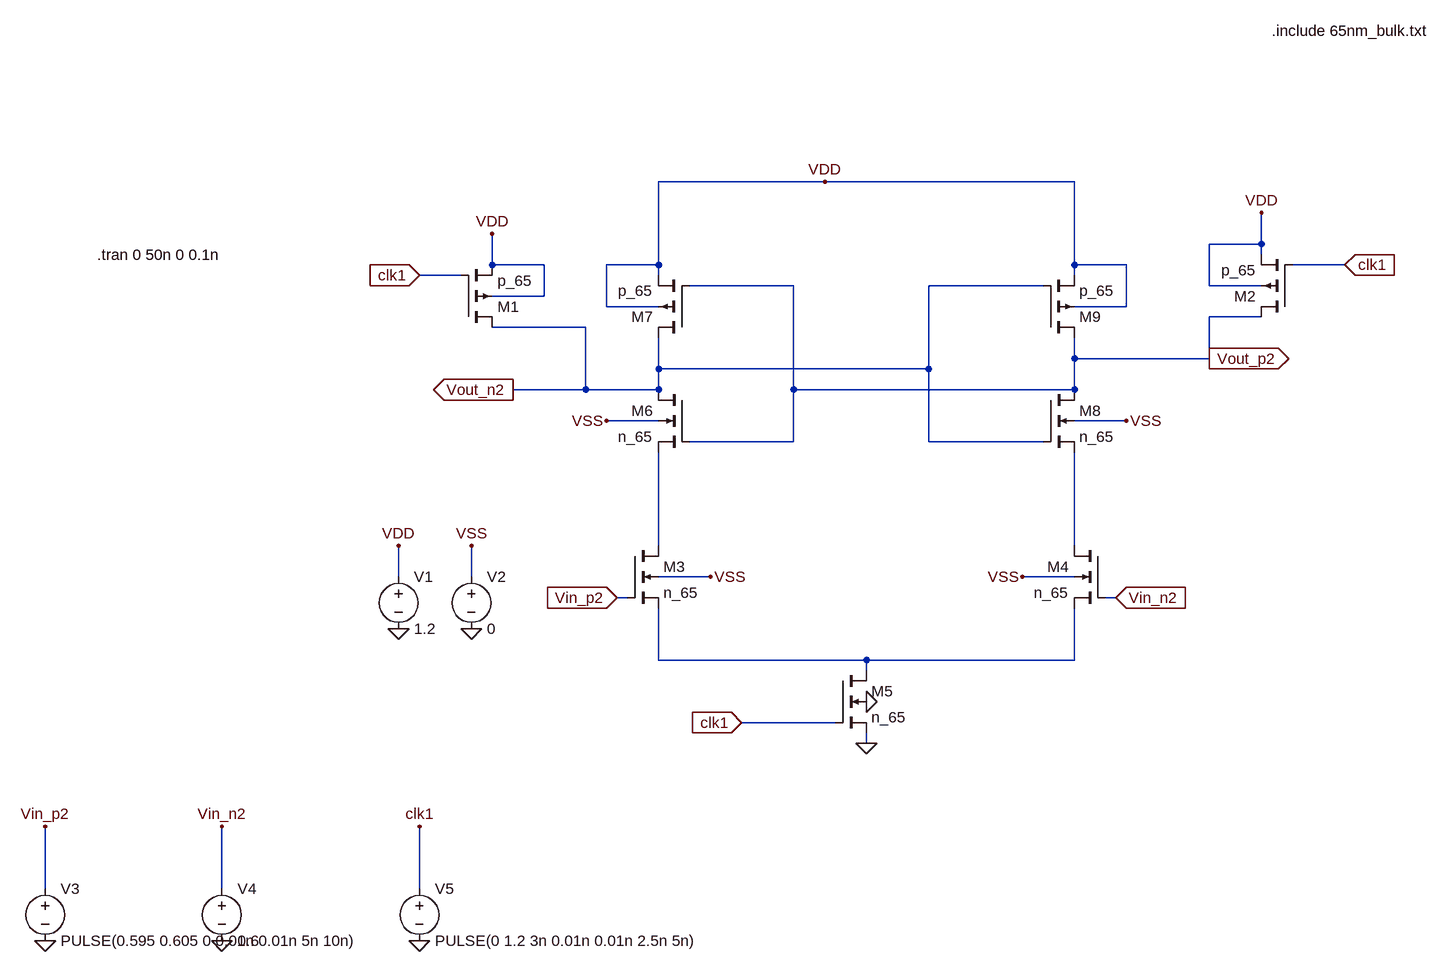
[diagram p0: schematic dyn_comp_testing.asc]
dyn_comp_testing.asc, the LTspice schematic file:
Version 4
SHEET 1 1784 1136
WIRE 848 -48 592 -48
WIRE 1232 -48 848 -48
WIRE 1520 48 1520 0
WIRE 1520 48 1440 48
WIRE 1520 64 1520 48
WIRE 336 80 336 32
WIRE 416 80 336 80
WIRE 592 80 592 -48
WIRE 592 80 512 80
WIRE 1232 80 1232 -48
WIRE 1312 80 1232 80
WIRE 1648 80 1568 80
WIRE 288 96 224 96
WIRE 592 96 592 80
WIRE 1232 96 1232 80
WIRE 800 112 640 112
WIRE 1184 112 1008 112
WIRE 1440 112 1440 48
WIRE 1520 112 1440 112
WIRE 416 128 416 80
WIRE 416 128 336 128
WIRE 512 144 512 80
WIRE 592 144 512 144
WIRE 1312 144 1312 80
WIRE 1312 144 1232 144
WIRE 1520 160 1440 160
WIRE 480 176 336 176
WIRE 1232 224 1232 192
WIRE 1440 224 1440 160
WIRE 1440 224 1232 224
WIRE 592 240 592 192
WIRE 1008 240 1008 112
WIRE 1008 240 592 240
WIRE 480 272 480 176
WIRE 480 272 368 272
WIRE 592 272 592 240
WIRE 592 272 480 272
WIRE 800 272 800 112
WIRE 1232 272 1232 224
WIRE 1232 272 800 272
WIRE 592 320 512 320
WIRE 1312 320 1232 320
WIRE 800 352 800 272
WIRE 800 352 640 352
WIRE 1008 352 1008 240
WIRE 1184 352 1008 352
WIRE 592 512 592 368
WIRE 1232 512 1232 368
WIRE 192 560 192 512
WIRE 304 560 304 512
WIRE 672 560 592 560
WIRE 1232 560 1152 560
WIRE 544 592 528 592
WIRE 1296 592 1280 592
WIRE 592 688 592 608
WIRE 912 688 592 688
WIRE 1232 688 1232 608
WIRE 1232 688 912 688
WIRE 912 704 912 688
WIRE 864 784 720 784
WIRE 912 816 912 800
WIRE -352 1040 -352 944
WIRE -80 1040 -80 944
WIRE 224 1040 224 944
FLAG 192 640 0
FLAG 192 512 VDD
FLAG 304 640 0
FLAG 304 512 VSS
FLAG 336 32 VDD
FLAG 1520 0 VDD
FLAG 224 96 clk1
IOPIN 224 96 In
FLAG 1648 80 clk1
IOPIN 1648 80 In
FLAG 720 784 clk1
IOPIN 720 784 In
FLAG 1296 592 Vin_n2
IOPIN 1296 592 In
FLAG 528 592 Vin_p2
IOPIN 528 592 In
FLAG 912 816 0
FLAG 1152 560 VSS
FLAG 672 560 VSS
FLAG 912 752 0
FLAG 848 -48 VDD
FLAG 512 320 VSS
FLAG 1312 320 VSS
FLAG 368 272 Vout_n2
IOPIN 368 272 Out
FLAG 1440 224 Vout_p2
IOPIN 1440 224 Out
FLAG 224 1120 0
FLAG -80 1120 0
FLAG -352 1120 0
FLAG 224 944 clk1
FLAG -80 944 Vin_n2
FLAG -352 944 Vin_p2
SYMBOL Voltage 192 544 R0
SYMATTR InstName V1
SYMATTR Value 1.2
SYMBOL Voltage 304 544 R0
SYMATTR InstName V2
SYMATTR Value 0
SYMBOL pmos4 288 176 M180
SYMATTR InstName M1
SYMATTR Value p_65
SYMATTR Value2 l=65n w=1u
SYMBOL pmos4 1568 160 R180
SYMATTR InstName M2
SYMATTR Value p_65
SYMATTR Value2 l=65n w=1u
SYMBOL nmos4 544 512 R0
SYMATTR InstName M3
SYMATTR Value n_65
SYMATTR Value2 l=0.1u w=10u
SYMBOL nmos4 1280 512 M0
SYMATTR InstName M4
SYMATTR Value n_65
SYMATTR Value2 l=0.1u w=10u
SYMBOL nmos4 864 704 R0
SYMATTR InstName M5
SYMATTR Value n_65
SYMATTR Value2 l=1u w=20u
SYMBOL nmos4 640 272 M0
SYMATTR InstName M6
SYMATTR Value n_65
SYMATTR Value2 l=65n w=0.8u
SYMBOL pmos4 640 192 R180
SYMATTR InstName M7
SYMATTR Value p_65
SYMATTR Value2 l=65n w=1.6u
SYMBOL nmos4 1184 272 R0
SYMATTR InstName M8
SYMATTR Value n_65
SYMATTR Value2 l=65n w=0.8u
SYMBOL pmos4 1184 192 M180
SYMATTR InstName M9
SYMATTR Value p_65
SYMATTR Value2 l=65n w=1.6u
SYMBOL voltage -352 1024 R0
SYMATTR InstName V3
SYMATTR Value PULSE(0.595 0.605 0 0.01n 0.01n 5n 10n)
SYMBOL voltage -80 1024 R0
SYMATTR InstName V4
SYMATTR Value 0.6
SYMBOL voltage 224 1024 R0
SYMATTR InstName V5
SYMATTR Value PULSE(0 1.2 3n 0.01n 0.01n 2.5n 5n)
TEXT 1536 -280 Left 2 !.include 65nm_bulk.txt
TEXT -272 64 Left 2 !.tran 0 50n 0 0.1n

The netlist it stands for:
* dyn_comp_testing.asc
V1 VDD 0 1.2
V2 VSS 0 0
M1 Vout_n2 clk1 VDD VDD p_65 l=65n w=1u
M2 Vout_p2 clk1 VDD VDD p_65 l=65n w=1u
M3 N001 Vin_p2 N003 VSS n_65 l=0.1u w=10u
M4 N002 Vin_n2 N003 VSS n_65 l=0.1u w=10u
M5 N003 clk1 0 0 n_65 l=1u w=20u
M6 Vout_n2 Vout_p2 N001 VSS n_65 l=65n w=0.8u
M7 Vout_n2 Vout_p2 VDD VDD p_65 l=65n w=1.6u
M8 Vout_p2 Vout_n2 N002 VSS n_65 l=65n w=0.8u
M9 Vout_p2 Vout_n2 VDD VDD p_65 l=65n w=1.6u
V3 Vin_p2 0 PULSE(0.595 0.605 0 0.01n 0.01n 5n 10n)
V4 Vin_n2 0 0.6
V5 clk1 0 PULSE(0 1.2 3n 0.01n 0.01n 2.5n 5n)
.model NMOS NMOS
.model PMOS PMOS
.lib standard.mos
.include 65nm_bulk.txt
.tran 0 50n 0 0.1n
.backanno
.end